# EAGLE design Radar_board (EAGLE 9.4.0)
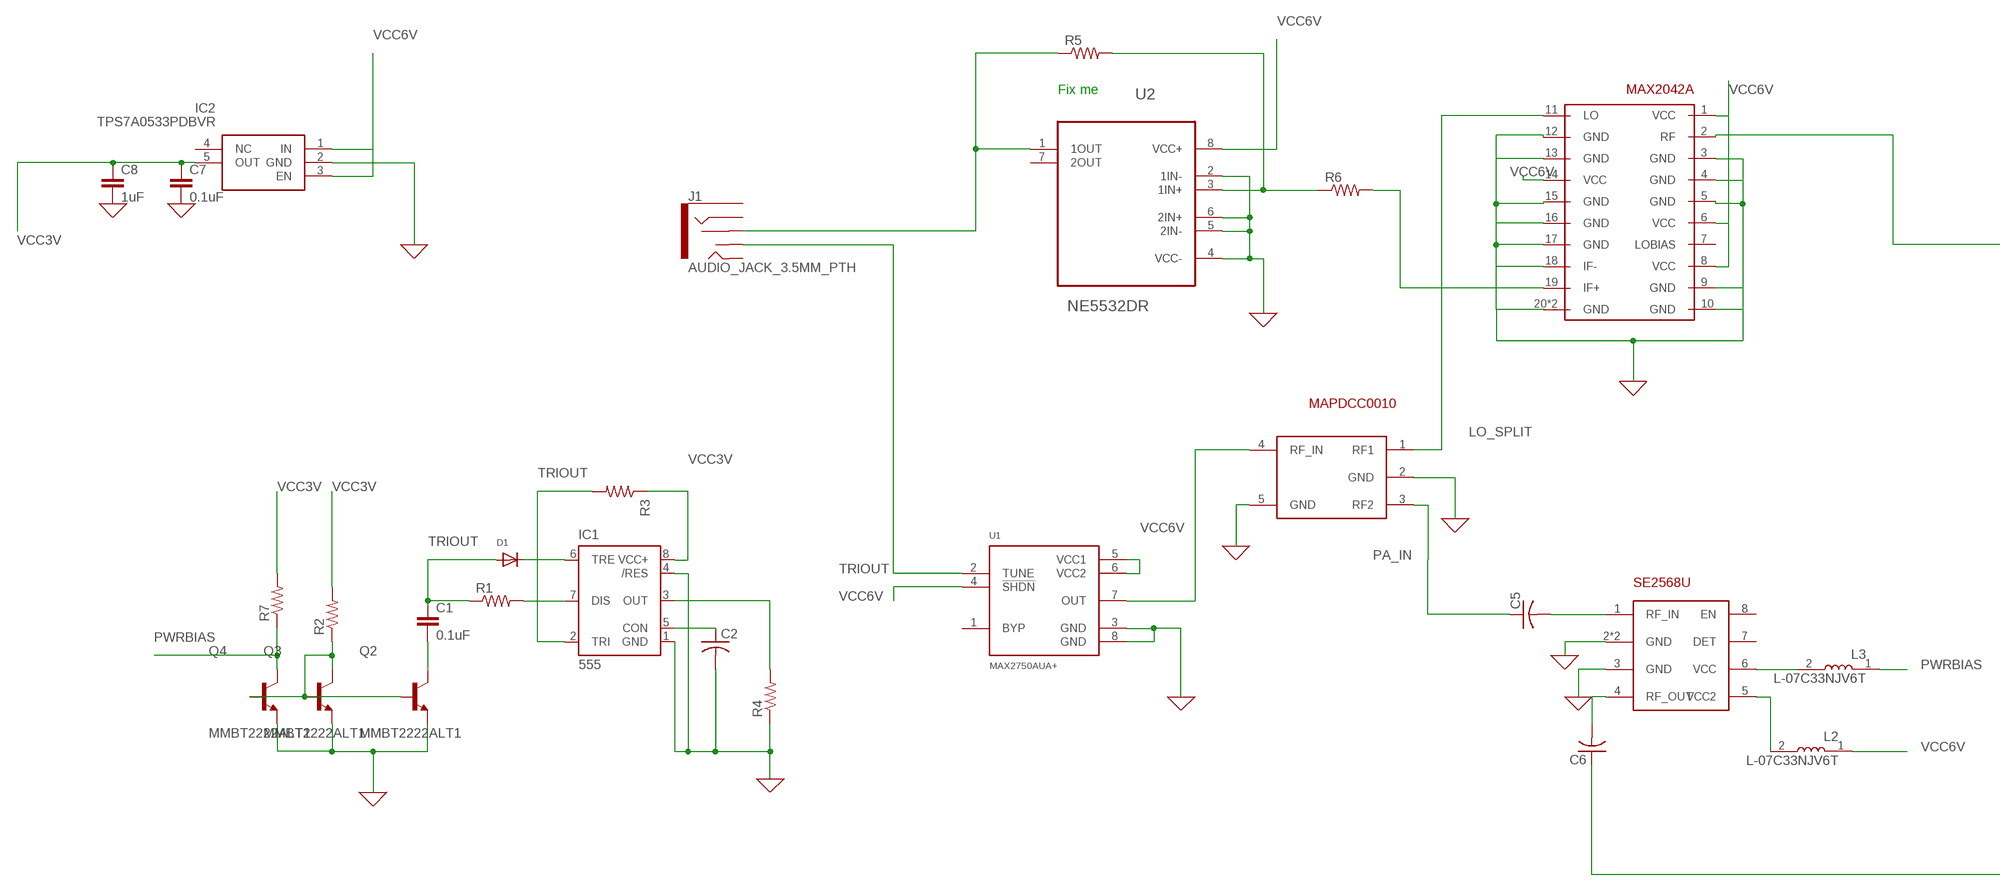
[diagram p0: schematic, sheet 1, part 1 of 2]
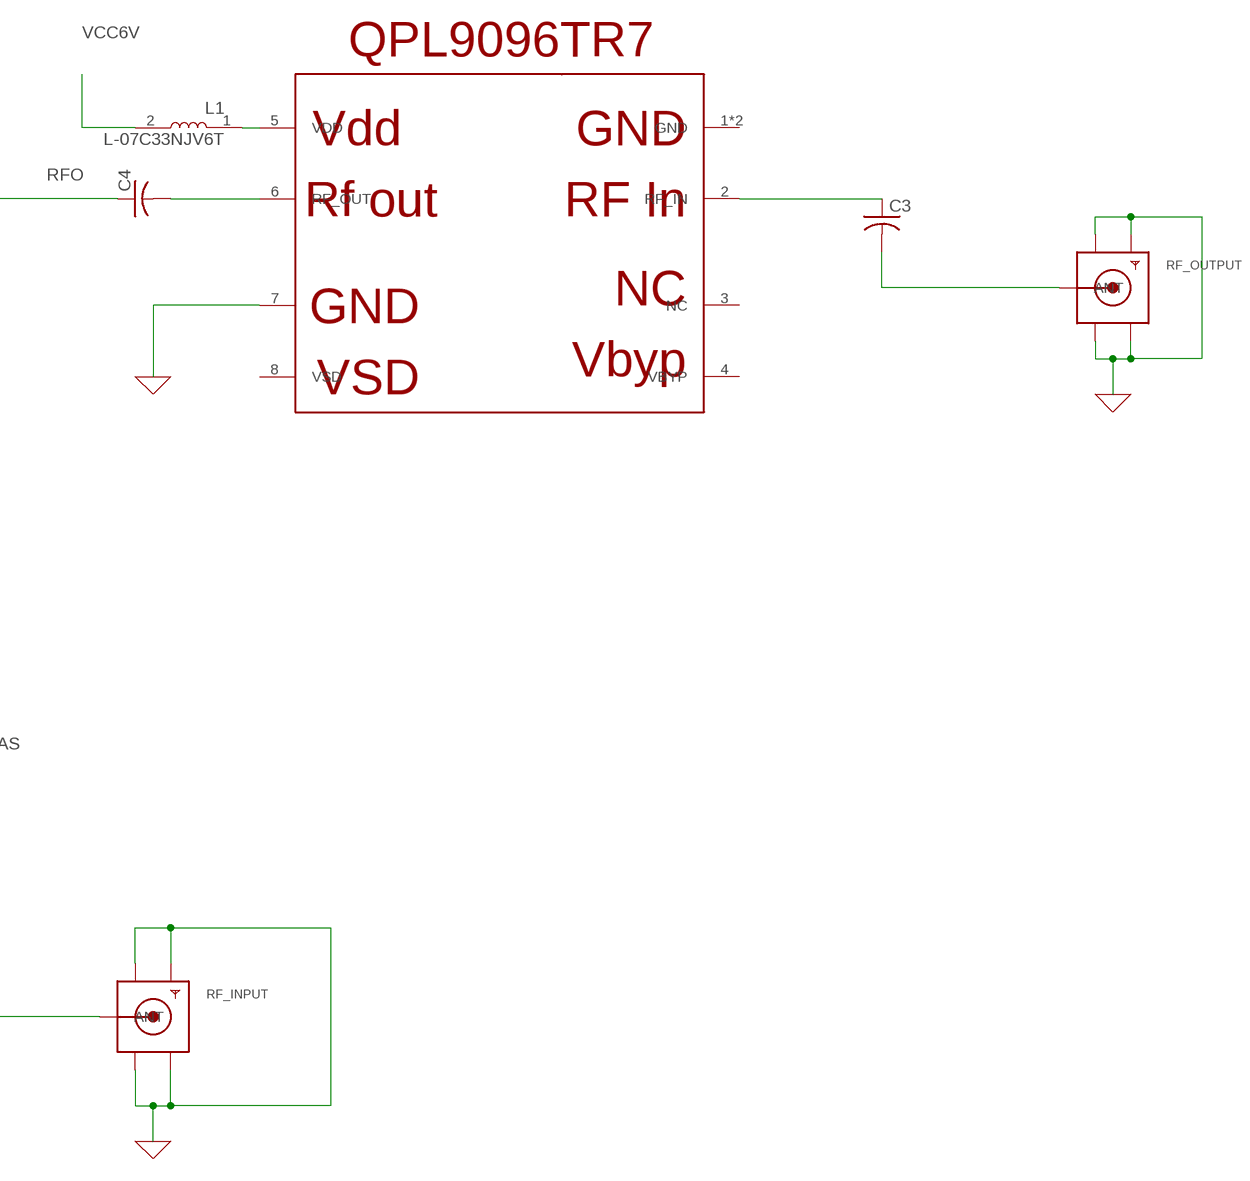
[diagram p1: schematic, sheet 1, part 2 of 2]

## Parts
C1  0.1uF  .1UF-CER  [0402-CAP]
C2  C-USC0603  [C0603]
C3  C-USC0805  [C0805]
C4  C-USC0805  [C0805]
C5  C-USC0805  [C0805]
C6  C-USC0805  [C0805]
C7  0.1uF  .1UF-CER  [0402-CAP]
C8  1uF  .1UF-CER  [0402-CAP]
D1  DIODE_SOD-123FL  [SOD-123FL]
IC1  555  555D  [SO08]
IC2  TPS7A0533PDBVR  [SOT95P280X145-5N]
J1  AUDIO_JACK_3.5MM_PTH  [AUDIO-JACK]
L1  L-07C33NJV6T  [INDC1005X60N]
L2  L-07C33NJV6T  [INDC1005X60N]
L3  L-07C33NJV6T  [INDC1005X60N]
Q2  MMBT2222ALT1  [SOT95P237X111-3N]
Q3  MMBT2222ALT1  [SOT95P237X111-3N]
Q4  MMBT2222ALT1  [SOT95P237X111-3N]
R1  R-US_R0603  [R0603]
R2  R-US_R0603  [R0603]
R3  R-US_R0603  [R0603]
R4  R-US_R0603  [R0603]
R5  R-US_R0603  [R0603]
R6  R-US_R0603  [R0603]
R7  R-US_R0603  [R0603]
RF_INPUT  SMACONNECTOR_EDGE  [SMA_EDGELAUNCH]
RF_OUTPUT  SMACONNECTOR_EDGE  [SMA_EDGELAUNCH]
U1  MAX2750AUA+  [SOP65P490X110-8N]
U2  NE5532DR  [SOIC127P600X175-8N]
U$1  QPL9096TR7DFT-8  [SON50P202X202X80-9T80X160]
U$2  MAX2042AT2055  [QFN65P500X500X80-21T310]
U$3  SE2568UDFN8  [SON50P202X202X80-9T80X160]
U$4  MAPDCC0010SOT-25  [SOT95P284X110-5]

## Nets
GND: C2.2 C7.2 C8.2 IC1.1(GND) IC1.4(/RES) IC2.2(GND) Q2.2(E) Q3.2(E) Q4.2(E) R4.1 RF_INPUT.GND@1(GND4) RF_INPUT.GND@2(GND3) RF_INPUT.GND@3(GND2) RF_INPUT.GND@4(GND1) RF_OUTPUT.GND@1(GND4) RF_OUTPUT.GND@2(GND3) RF_OUTPUT.GND@3(GND2) RF_OUTPUT.GND@4(GND1) U1.3(GND) U1.8(GND) U2.2(1IN-) U2.4(VCC-) U2.5(2IN-) U2.6(2IN+) U$1.7 U$2.3(GND) U$2.4(GND) U$2.5(GND) U$2.9(GND) U$2.10(GND) U$2.12(GND) U$2.13(GND) U$2.15(GND) U$2.16(GND) U$2.17(GND) U$2.18(IF-) U$2.20(GND) U$2.21(GND) U$3.2(GND) U$3.3(GND) U$3.9(GND) U$4.2(GND) U$4.5(GND)
LO [RF1]: U1.7(OUT) U$4.4(RF_IN)
LO_SPLIT [RF1]: U$2.11(LO) U$4.1(RF1)
N$1: Q2.1(B) Q3.1(B) Q3.3(C) Q4.1(B) R2.1
N$2: C1.2 Q2.3(C)
N$3: IC1.7(DIS) R1.2
N$4: IC1.3(OUT) R4.2
N$5: C2.1 IC1.5(CON)
N$6: D1.C IC1.6(TRE)
N$7: L2.2 U$3.5(VCC2)
N$8 [RF1]: C3.1 U$1.2(RF_IN)
N$9: L1.1 U$1.5(VDD)
N$10 [RF1]: C3.2 RF_OUTPUT.P(ANT)
N$11 [RF1]: C5.2 U$3.1(RF_IN)
N$12 [RF1]: C6.2 U$3.4(RF_OUT)
N$13: C4.2 U$1.6(RF_OUT)
N$14 [RF1]: C6.1 RF_INPUT.P(ANT)
N$15: J1.RSH R5.1 U2.1(1OUT)
N$16: R5.2 R6.1 U2.3(1IN+)
PA_IN [RF1]: C5.1 U$4.3(RF2)
PWRBIAS: L3.1 Q4.3(C) R7.1
RFO [RF1]: C4.1 U$2.2(RF)
TRIOUT: C1.1 D1.A IC1.2(TRI) J1.TSH R1.1 R3.2 U1.2(TUNE)
TV_IN: R6.2 U$2.19(IF+)
VCC1V: L3.2 U$3.6(VCC)
VCC3V: C7.1 C8.1 IC1.8(VCC+) IC2.5(OUT) R2.2 R3.1 R7.2
VCC6V: IC2.1(IN) IC2.3(EN) L1.2 L2.1 U1.4(!SHDN) U1.5(VCC1) U1.6(VCC2) U2.8(VCC+) U$2.1(VCC) U$2.6(VCC) U$2.8(VCC) U$2.14(VCC)
Unconnected: IC2.4(NC) J1.RING J1.SLEEVE J1.TIP U1.1(BYP) U2.7(2OUT) U$1.1(GND) U$1.3(NC) U$1.4(VBYP) U$1.8(VSD) U$1.9(GND) U$2.7(LOBIAS) U$3.7(DET) U$3.8(EN)

## Notes on the sheet
- Fix me

## Library data of the parts
C1 C7 = SparkFun-Retired:.1UF-CER: .1uF ceramic SMT CAP-00810- 25V +80%/-20% (0603) CAP-08390- 100V 10% (0603) CAP-08604- 25V 5% (0603); PROD_ID: CAP-00810
C2-C6 = adafruit:C-US: CAPACITOR, American symbol
C8 = SparkFun-Retired:.1UF-CER: .1uF ceramic SMT CAP-00810- 25V +80%/-20% (0603) CAP-08390- 100V 10% (0603) CAP-08604- 25V 5% (0603); PROD_ID: CAP-00810; VALUE: 0.1uF
D1 = adafruit:DIODE: Diode SMADIODE - SMA Surface Mount Package 20V 1A Schottky Diode Digikey: 641-1014-6-ND DO-1N4148 - Through Hole Small Current Diode SOD-123 20V 1 A (.5mV Vf) Schottky Diode - Digikey: MBRX120TPMSCT-ND SOD-323 10V 570mA (.38mV Vf, 3ns) Schottky Diode - Digikey: ZLLS410CT-ND SOD-523 30V 30mA Schottky Diode (RB751S-40TE61) - Digikey: RB751S-40TE61CT-ND SOT23-R/W - SOT23 Package (R = Solder Paste/Reflow Ovens, W = Hand-Soldering) BAT54Film 40V 300mA - Digikey: 497-7162-1-ND
IC1 = SparkFun-IC-Special-Function:555: General purpose bipolar Timer Datasheet <http://www.sparkfun.com/datasheets/Components/General/ne555.pdf> SparkFun Products SparkFun SparkPunk Sequencer Kit <https://www.sparkfun.com/products/12707> (KIT-12707) Storefront Component: 555 Timer <https://www.sparkfun.com/products/9273> (COM-09273) Two parts valid for production: VFP: IC-11930 (M7555 PTH) VFP: IC-09173 (555 PTH) - Preferred; PROD_ID: NA-XXXXX
IC2 = SamacSys_Parts:TPS7A0533PDBVR: 1-A, ultra-low-IQ, 200-mA low-dropout (LDO) regulator in a small-sized package Source: Datasheet <http://www.ti.com/lit/gpn/tps7a05>; DESCRIPTION: 1-A, ultra-low-IQ, 200-mA low-dropout (LDO) regulator in a small-sized package; HEIGHT: 1.45mm; MANUFACTURER_NAME: Texas Instruments; MANUFACTURER_PART_NUMBER: TPS7A0533PDBVR; MOUSER_PART_NUMBER: 595-TPS7A0533PDBVR; MOUSER_PRICE-STOCK: https://www.mouser.com/Search/Refine.aspx?Keyword=595-TPS7A0533PDBVR
J1 = SparkFun-Connectors:AUDIO_JACK_3.5MM: Audio Jack 3.5mm variants of PTH and SMT stereo audio jack with bypass switches. SparkFun Products: SparkFun SparkPunk Sound Kit <[https://www.sparkfun.com/products/11177]> - PTH MP3 Trigger <https://www.sparkfun.com/products/13720> -3.5mm SMD SparkFun PicoBoard <https://www.sparkfun.com/products/11888>- 2.5mm SMD; PROD_ID: CONN-08774; SF_ID: PRT-08032
L1-L3 = L-07C33NJV6T:L-07C33NJV6T: FIXED IND 33NH 200MA 1 OHM SMD; AVAILABILITY: Unavailable; DESCRIPTION: Inductor, Ceramic, 33nH, 5+% Tol, 5-% Tol, 0402-Case; MF: Johanson Technology; MP: L-07C33NJV6T; PACKAGE: 0402 Johanson; PRICE: None
Q2-Q4 = MMBT2222ALT1:MMBT2222ALT1: Trans NPN 40V 0.6A SOT23; AVAILABILITY: Unavailable; DESCRIPTION: Trans NPN 40V 0.6A SOT23; MF: ON Semiconductor; MP: MMBT2222ALT1; PACKAGE: SOT-23 Motorola; PRICE: None
R1-R7 = adafruit:R-US_: RESISTOR, American symbol
RF_INPUT RF_OUTPUT = adafruit:SMACONNECTOR: SMA Connector 90° DIP SMA Connector, 50 Ohm (4UConnector: 07259)
U1 = MAX2750AUA_:MAX2750AUA+: Controlled Oscillator 2.4GHz to 2.5GHz VCXO 8-Pin uMAX; DESCRIPTION: 2.4GHz Monolithic Voltage-Controlled Oscillator for Automotive; DIGI-KEY_PART_NUMBER: MAX2750AUA+-ND; DIGI-KEY_PURCHASE_URL: https://www.digikey.com/product-detail/en/maxim-integrated/MAX2750AUA-/MAX2750AUA--ND/1937439?utm_source=snapeda&utm_medium=aggregator&utm_campaign=symbol; MF: Maxim Integrated; MP: MAX2750AUA+; PACKAGE: MSOP-8 Maxim Integrated
U2 = NE5532DR:NE5532DR: DUAL LOW-NOISE OPERATIONAL AMPLIFIERS; AVAILABILITY: Unavailable; DESCRIPTION: Dual Low-Noise High-Speed Audio Operational Amplifier 8-SOIC 0 to 70; MF: Texas Instruments; MP: NE5532DR; PACKAGE: SOIC-8 Texas Instruments; PRICE: None
U$1 = QPL9096TR7:QPL9096TR7
U$2 = MAX2042:MAX2042A
U$3 = SE2568U-R:SE2568U
U$4 = MAPDCC0010:MAPDCC0010

## Net classes
0 default: clearance 0.508 mm
1 RF1: clearance 1.27 mm

## Board
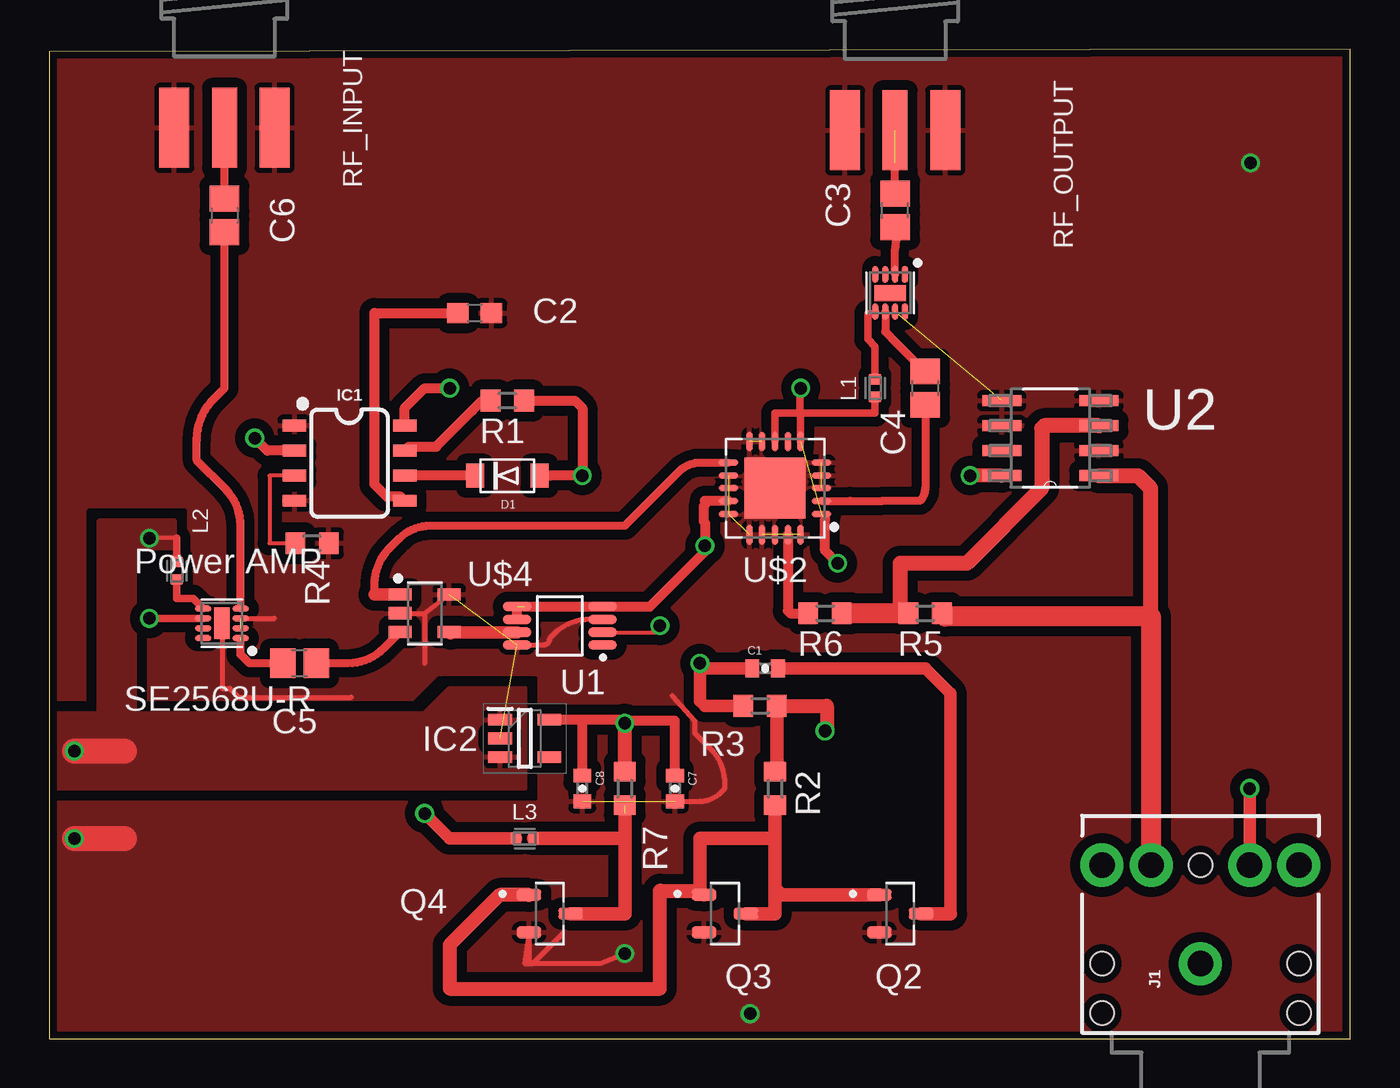
[diagram p2: board, top side]
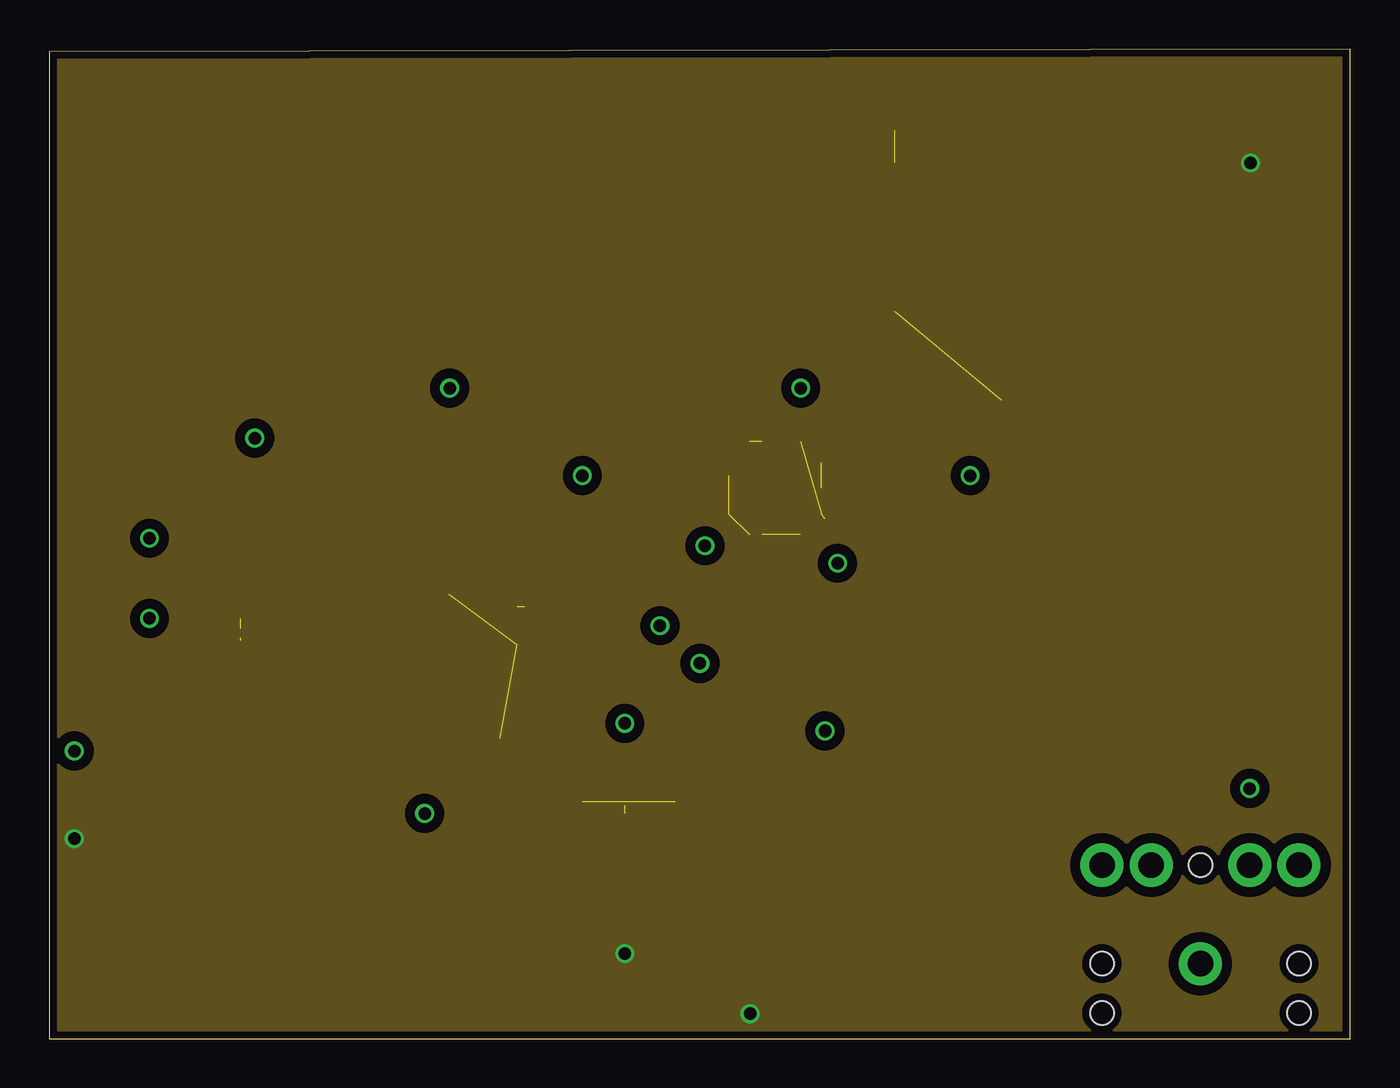
[diagram p3: board, inner layer Route2]
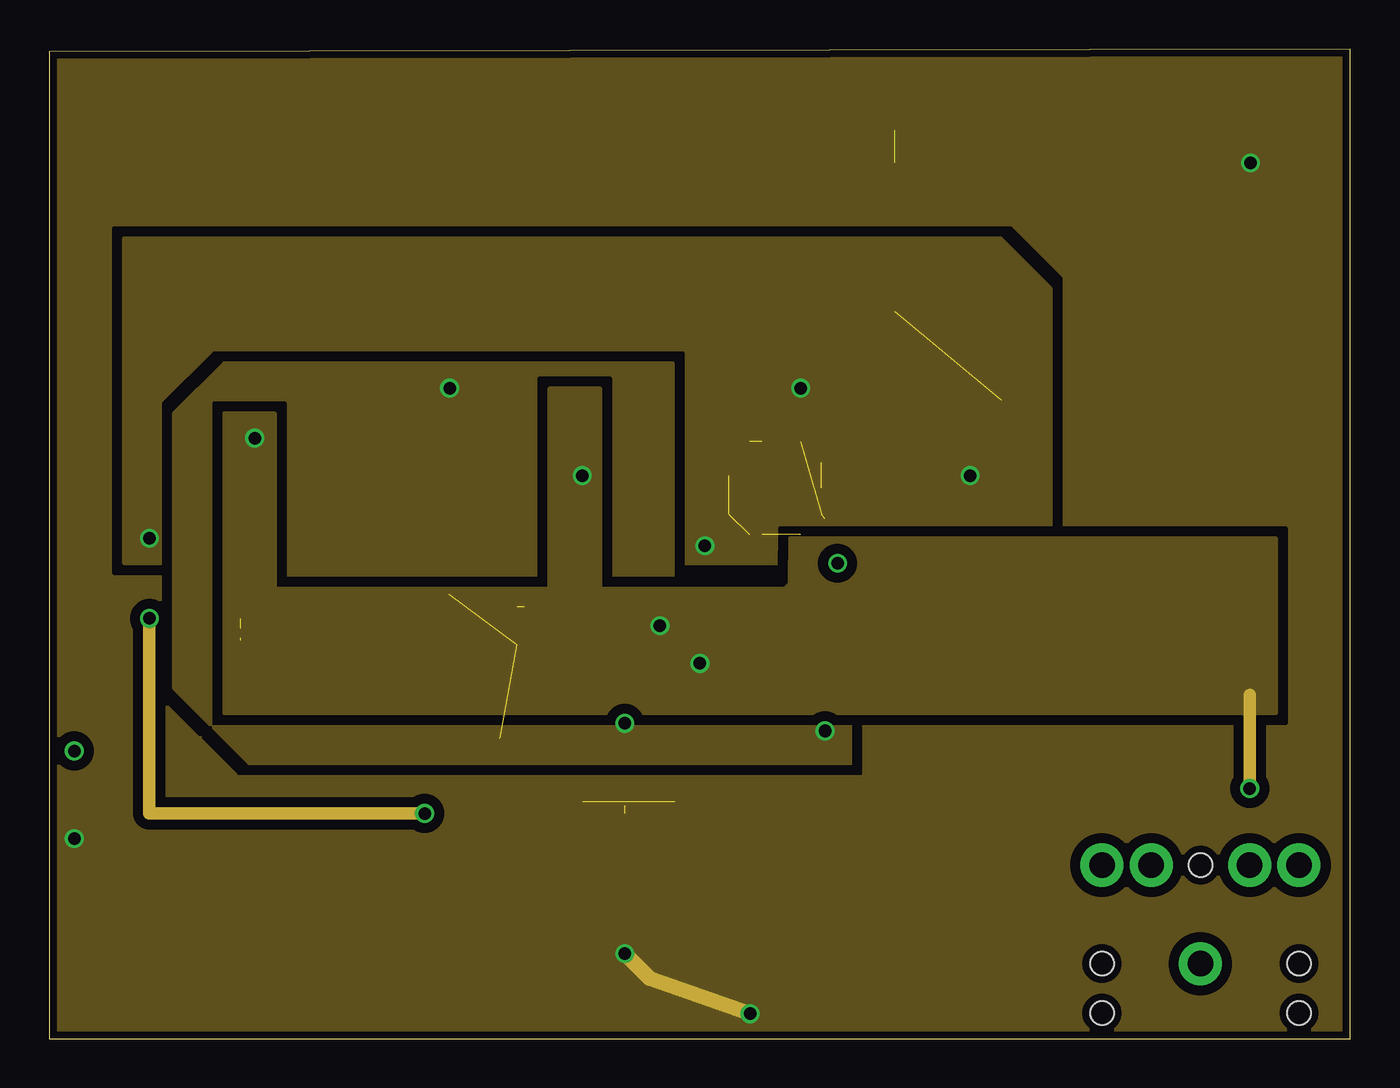
[diagram p4: board, inner layer Route15]
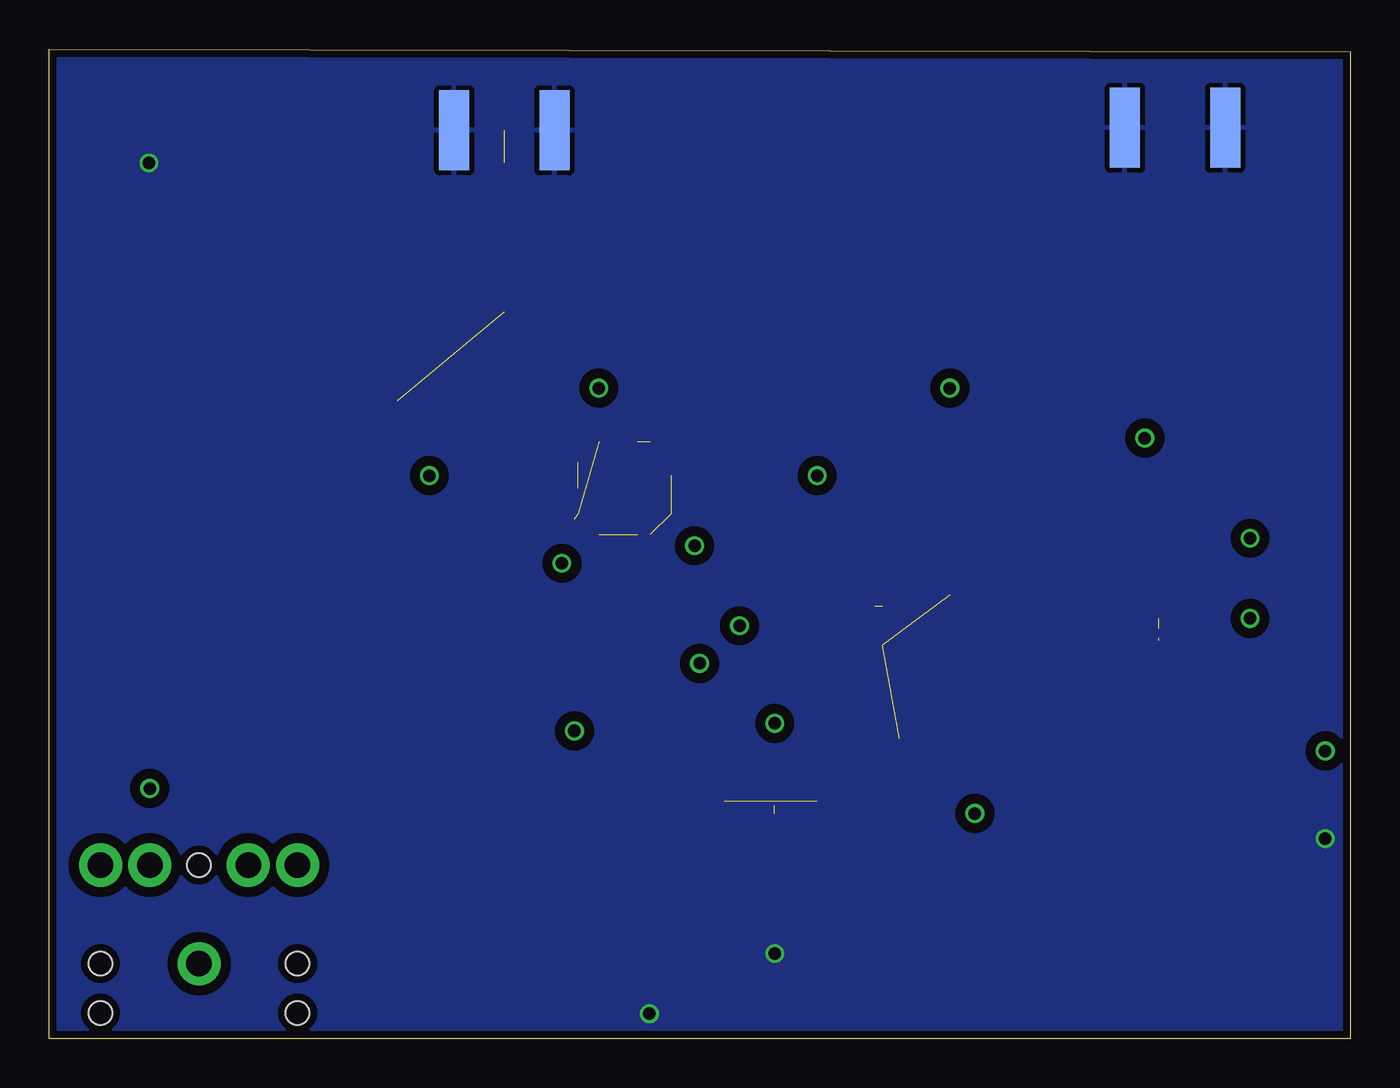
[diagram p5: board, bottom side, seen from below]

Size 66.02 x 50.22 mm. Coordinates in mm from the lower left corner, seen from the top.
Outline: 0,0 66.02,0 66.02,50.22 0,50.09 0,0
Copper layers (1*2*15*16): Top 0.035559375mm / dielectric 0.17018125mm / Route2 0.01778125mm / dielectric 47mil / Route15 0.01778125mm / dielectric 0.17018125mm / Bottom 0.035559375mm
Design rules "oshpark-4layer": minimum track width 5mil, minimum drill 10mil, track to track 5mil, track to pad 5mil, pad to pad 5mil, via to via 5mil, smd to smd 5mil, copper to edge 15mil, drill to drill 6mil, minimum pad ring 4mil, minimum via ring 4mil, stop-mask expansion 2.5mil, vias tented up to drill 0mil, thermal gap 10mil

### Footprints (pad centres in the part's own frame; a part is rotated, then mirrored left to right if it is on the bottom)
0402-CAP = smd 0.7 x 0.9: 1 -0.65,0; 2 0.65,0
C0603 = smd 1.1 x 1: 1 -0.85,0; 2 0.85,0
C0805 = smd 1.3 x 1.5: 1 -0.85,0; 2 0.85,0
SOD-123FL = smd 0.91 x 1.22: A 1.637,0; C -1.637,0
SO08 = smd 0.6 x 1.2: 1 -1.905,-2.8; 2 -0.635,-2.8; 3 0.635,-2.8; 4 1.905,-2.8; 5 1.905,2.8; 6 0.635,2.8; 7 -0.635,2.8; 8 -1.905,2.8
SOT95P280X145-5N = smd 1.2 x 0.6: 1 -1.25,0.95; 2 -1.25,0; 3 -1.25,-0.95; 4 1.25,-0.95; 5 1.25,0.95
AUDIO-JACK = drill 1.3 pad 2.184: RING 5,5; RSH 5,2.5; SLEEVE 0,0; TIP 5,-5; TSH 5,-2.5 | hole 1.2: 0,5; -2.5,5; -2.5,-5; 0,-5; 5,0
INDC1005X60N = smd 0.54 x 0.63: 1 -0.445,0; 2 0.445,0
SOT95P237X111-3N = smd 1.23 x 0.6: 1 -1.06,0.95; 2 -1.06,-0.95; 3 1.06,0
R0603 = smd 1 x 1.1: 1 -0.85,0; 2 0.85,0
SMA_EDGELAUNCH = smd 4.064 x 1.524: GND@1 2.032,-2.54; GND@2 2.032,2.54 | smd 4.064 x 1.524 bottom: GND@3 2.032,2.54; GND@4 2.032,-2.54 | smd 4.064 x 1.27: P 2.032,0
SOP65P490X110-8N = smd 1.42 x 0.47: 1 -2.165,0.975; 2 -2.165,0.325; 3 -2.165,-0.325; 4 -2.165,-0.975; 5 2.165,-0.975; 6 2.165,-0.325; 7 2.165,0.325; 8 2.165,0.975
SOIC127P600X175-8N = smd 1.981 x 0.559: 1 -2.464,1.905; 2 -2.464,0.635; 3 -2.464,-0.635; 4 -2.464,-1.905; 5 2.464,-1.905; 6 2.464,-0.635; 7 2.464,0.635; 8 2.464,1.905
SON50P202X202X80-9T80X160 = smd 0.831 x 0.292: 1 -0.946,0.75; 2 -0.946,0.25; 3 -0.946,-0.25; 4 -0.946,-0.75; 5 0.946,-0.75; 6 0.946,-0.25; 7 0.946,0.25; 8 0.946,0.75 | smd 0.8 x 1.6: 9 0,0
QFN65P500X500X80-21T310 = smd 0.987 x 0.32: 1 -2.362,1.3; 2 -2.362,0.65; 3 -2.362,0; 4 -2.362,-0.65; 5 -2.362,-1.3; 11 2.362,-1.3; 12 2.362,-0.65; 13 2.362,0; 14 2.362,0.65; 15 2.362,1.3 | smd 0.32 x 0.987: 6 -1.3,-2.362; 7 -0.65,-2.362; 8 0,-2.362; 9 0.65,-2.362; 10 1.3,-2.362; 16 1.3,2.362; 17 0.65,2.362; 18 0,2.362; 19 -0.65,2.362; 20 -1.3,2.362 | smd 3.1 x 3.1: 21 0,0
SOT95P284X110-5 = smd 1.156 x 0.62: 1 -1.246,0.95; 2 -1.246,0; 3 -1.246,-0.95; 4 1.246,-0.95; 5 1.246,0.95

### Placement (x,y rotation side)
C1  36.32,18.8 0 top
C2  21.59,36.83 0 top
C3  42.93,42.04 90 top
C4  44.45,33.02 90 top
C5  12.7,19.05 180 top
C6  8.89,41.78 270 top
C7  31.75,12.7 270 top
C8  27.05,12.7 270 top
D1  23.24,28.57 0 top
IC1  15.24,29.21 270 top
IC2  24.13,15.24 0 top
J1  58.42,3.81 90 top
L1  41.91,33.02 270 top
L2  6.48,23.75 270 top
L3  24.13,10.16 180 top
Q2  43.18,6.35 0 top
Q3  34.29,6.35 0 top
Q4  25.4,6.35 0 top
R1  23.24,32.38 180 top
R2  36.83,12.7 90 top
R3  36.07,16.89 180 top
R4  13.34,25.15 180 top
R5  44.45,21.59 180 top
R6  39.37,21.59 180 top
R7  29.21,12.7 90 top
RF_INPUT  8.89,48.26 270 top
RF_OUTPUT  42.93,48.13 270 top
U1  25.91,20.95 180 top
U2  50.8,30.48 180 top
U$1  42.67,37.85 270 top
U$2  36.83,27.94 180 top
U$3  8.76,21.08 180 top
U$4  19.05,21.59 0 top

### Tracks (layer width: path | path; a pad name or v marks a point on that pad's centre or on a via)
GND  (via drill 0.64)  (13 unrouted)
  Top 0.203: 22.86,36.83 C2.2 | 12.32,31.11 IC1.1
  Top 0.254: U1.3 27.41,21.28 arc45 25.62,20.54 25.4,20.32 arc-90 25.06,19.98 U1.8 | U$3.3 11.43,21.33 | U$3.9 8.76,17.78 9.17,17.78 9.62,17.32 15.32,17.32 | C7.2 33.02,12.05 arc45 34.08,12.49 34.29,12.7 34.29,12.92 arc45 33.55,14.71 32.77,15.49 32.77,16.13 31.62,17.4 | Q4.2 24.13,3.81 24.52,3.81 26.04,5.33 | v29.21,4.32 27.94,3.81 24.38,3.81 24.38,5.33 | U$4.2 19.05,21.59 | 19.05,21.59 U$4.5 | 19.05,21.59 19.05,19.05
  Top 1.27: v1.27,10.16 3.81,10.16
  Route15 0.762: v29.21,4.32 30.48,3.05 v35.56,1.27
  other vias: 60.96,44.45
  pour Route15 (rank 4): 0,50.16 66.04,50.16 66.04,0 0,0
  pour Top (rank 2): 66.04,50.16 66.04,0 0,0 0,50.16
  pour Route2: 0,50.8 66.04,50.8 66.04,0 0,0
  pour Bottom: 0,50.8 66.04,50.8 66.04,0 0,0
LO
  Top 0.635: U$4.4 20.36,20.57 20.42,20.63 U1.7
LO_SPLIT
  Top 0.406: U$2.11 33.05,29.24 arc45 31.97,28.79 29.21,26.04 19.31,26.04 arc45 17.78,25.4 17.25,24.87 arc45 16.51,23.08 16.51,22.54
  Top 0.635: U$4.1 16.51,22.54
N$1
  Top 0.686: Q3.3 36.83,6.35 36.83,7.62 | 36.83,7.62 36.83,10.16 | 36.83,10.16 33.02,10.16 33.02,7.51 Q3.1 | Q2.1 37.15,7.3 36.83,7.62 | R2.1 36.83,10.16
  Top 0.708: Q4.1 22.86,7.3 20.32,4.76 20.32,2.54 30.99,2.54 30.99,7.49 31,7.51 33.02,7.51
N$2
  Top 0.635: C1.2 44.45,18.8 45.72,17.53 45.72,6.35
  Top 0.686: Q2.3 45.72,6.35
N$3
  Top 0.203: 21.97,32.38 R1.2
  Top 0.508: IC1.7 18.25,30.05 19.64,30.05 21.46,31.88 21.97,32.38
N$4
  Top 0.203: IC1.3 11.18,28.57 11.18,25.15 R4.2
N$5
  Top 0.203: 20.32,36.83 C2.1
  Top 0.508: IC1.5 17.83,27.51 17.12,27.51 16.51,28.13 16.51,36.83 20.32,36.83
N$6
  Top 0.203: IC1.6
  Top 0.508: D1.C IC1.6
N$7
  Top 0.381: L2.2 6.48,22.35 7.3,22.35 U$3.5
N$8
  Top 0.406: U$1.2 42.92,40.08 arc-45 43.38,41.19
  Top 0.635: C3.1 43.38,41.19
N$9
  Top 0.203: U$1.5
  Top 0.381: L1.1 41.91,35.13 41.53,35.51 41.53,36.8 41.82,36.8 U$1.5
N$10  (1 unrouted)
  Top 0.406: C3.2 42.93,44.45
N$11  (1 unrouted)
  Top 0.406: C5.2 10.16,19.05 9.71,19.5 9.71,20.22
N$12
  Top 0.381: C6.2 8.96,40.86 | U$3.4 9.71,22.35
  Top 0.406: 9.71,22.35 9.71,26.07 arc45 8.96,27.86 7.49,29.34 7.49,30.39 arc-45 8.36,32.49 8.89,33.02 C6.2
  Top 0.635: 8.95,40.8 arc45 C6.2
N$13
  Top 0.203: 42.96,35.34 42.99,35.31
  Top 0.381: 42.42,35.88
  Top 0.406: 42.42,35.88 42.96,35.34 42.42,35.88 | U$1.6 42.42,35.88 | 42.99,35.31 44.41,33.88
  Top 0.635: 44.41,33.88 arc45 C4.2
N$14
  Top 0.406: C6.1 RF_INPUT.P
N$15
  Top 0.203: 45.47,21.42 R5.1
  Top 0.762: U2.1 55.24,28.57 55.88,27.94 55.88,21.42
  Top 1.016: J1.RSH 55.92,21.39 55.74,21.42 | 55.74,21.42 55.88,21.42 | 55.74,21.42 45.47,21.42
N$16
  Top 0.203: U2.3 51.99,31.11 | 50.49,31.11 50.37,30.99
  Top 0.762: U2.3 50.49,31.11 | 50.37,30.99 50.37,27.94 46.55,24.13 43.18,24.13 43.18,22.01 R5.2
  Top 1.016: R5.2 R6.1
PA_IN
  Top 0.406: U$4.3 16.96,19.79 arc-45 15.16,19.05 C5.1
PWRBIAS  (1 unrouted)
  Top 0.686: Q4.3 29.21,6.35 29.21,10.16 | L3.1 29.21,10.16 | 29.21,11.43 29.21,10.16
RFO
  Top 0.203: 42.53,27.29 42.29,27.29
  Top 0.406: U$2.2 40.64,27.29 42.29,27.29 44.18,27.29 arc45 44.45,27.94 C4.1
TRIOUT  (via drill 0.64)
  Top 0.203: 25.4,28.57 D1.A | U1.2 30.99,20.63 v30.99,20.95
  Top 0.508: IC1.2 11.06,29.84 v10.43,30.48 | R1.1 26.67,32.38 27.05,32 v27.05,28.57 25.4,28.57
  Top 0.635: C1.1 33.27,18.8 v33.02,19.05 33.02,17.14 33.27,16.89 R3.2 | J1.TSH v60.92,12.7
  Route15 0.635: v60.92,12.7 60.92,17.46
  pour Route15: 8.89,31.75 11.43,31.75 11.43,22.86 25.4,22.86 25.4,33.02 27.94,33.02 27.94,22.86 37.34,22.86 37.59,23.11 37.61,25.4 62.23,25.4 62.23,16.52 8.89,16.52
TV_IN
  Top 0.508: R6.2 37.61,21.59 37.48,21.72 U$2.19
VCC1V  (via drill 0.64)
  Top 0.381: U$3.6 v5.08,21.33
  Top 0.635: v19.05,11.43 20.32,10.16 L3.2
  Route15 0.635: v5.08,21.33 5.08,11.43 v19.05,11.43
VCC3V  (via drill 0.64)
  Top 0.203: 20.32,32.89 v20.32,33.02
  Top 0.508: 27.05,16.19 29.02,16.19 v29.21,16 29.34,16.13 31.75,16.13 C7.1 | 27.05,16.19 IC2.5 | C8.1 27.05,16.19 | IC1.8 18.04,32.01 19.05,33.02 20.19,33.02 20.32,32.89
  Top 0.686: R2.2 36.92,13.55 R3.1
  Top 0.708: R7.2 v29.21,16 | v39.37,15.62 39.46,15.71 39.46,16.89 R3.1
  pour Route15 (rank 2): 8.89,34.29 31.62,34.29 31.62,16.51 40.64,16.51 40.64,13.97 10.16,13.97 6.35,17.78 6.35,31.75
VCC6V  (via drill 0.64)  (3 unrouted)
  Top 0.203: 38.1,31.75 38.13,31.75 | L2.1 6.22,24.45 | 6.48,25.4 v5.08,25.4
  Top 0.381: L2.1 6.48,25.4 | L1.2 41.91,31.75 38.1,31.75 | U$2.6 38.13,31.72 38.1,31.75 | 38.1,31.75 36.83,31.75 U$2.8 | 38.1,31.75 38.1,32.99 v38.13,33.02
  Top 0.508: v40.01,24.13 39.37,24.77 39.37,26.37 | U$2.14 33.27,27.29 33.27,27.08 33.21,27.02 33.21,26.26 33.27,26.2 v33.27,25.02 33.27,24.72 30.48,21.93 U1.4 24.13,21.93 | U1.6 U1.5
  Top 0.708: U2.8 v46.74,28.57
  Top 1.27: v1.27,14.61 2.54,14.61 3.81,14.61
  pour Route15 (rank 3): 6.35,24.13 3.81,24.13 3.81,40.64 31.75,40.64 48.26,40.64 50.8,38.1 50.8,26.67 50.8,24.13 31.75,24.13 31.75,34.29 16.51,34.29
  pour Top: 20.32,17.78 24.13,17.78 24.13,12.7 0,12.7 0,16.51 2.54,16.51 2.54,26.29 6.35,26.29 6.35,24.89 4.32,24.89 4.32,16.51 19.05,16.51